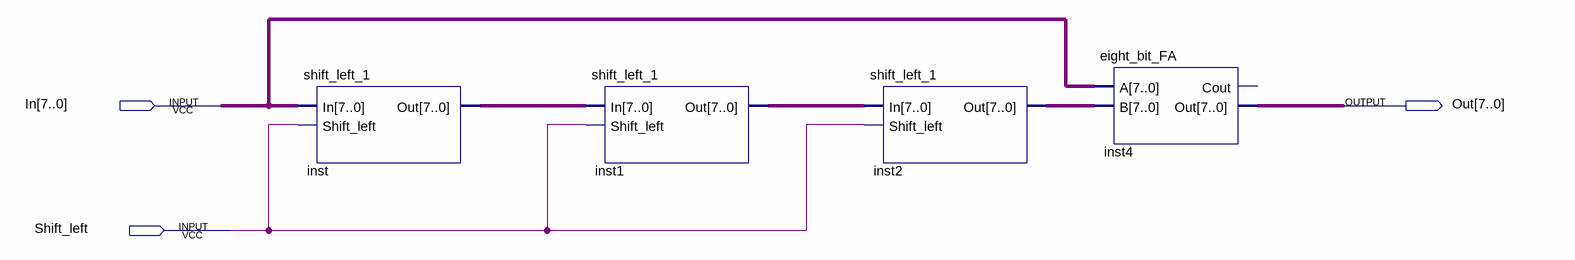
[diagram p0: schematic sheet]
// Quartus schematic multiply_by9.bdf as structural Verilog: 4 symbols, 3 pins
module multiply_by9 (
  input  [7:0] In,
  input  Shift_left,
  output [7:0] Out
);

  wire [7:0] inst1_out, inst2_out, inst_out;

  shift_left_1 inst (.In(In), .Shift_left(Shift_left), .Out(inst_out));
  shift_left_1 inst1 (.In(inst_out), .Shift_left(Shift_left), .Out(inst1_out));
  shift_left_1 inst2 (.In(inst1_out), .Shift_left(Shift_left), .Out(inst2_out));
  eight_bit_FA inst4 (.A(In), .B(inst2_out), .Out(Out));  // open: Cout
endmodule
